# Altium schematic sheet TempController.SchDoc: TempController
size A3; ApprovedBy: ANBI; CheckedBy: ANBI; CompanyName: DongA FuelCell; DrawnBy: SEOKIPO; Engineer: SEOKIPO; Revision: 001; SheetNumber: 2; SheetTotal: 6
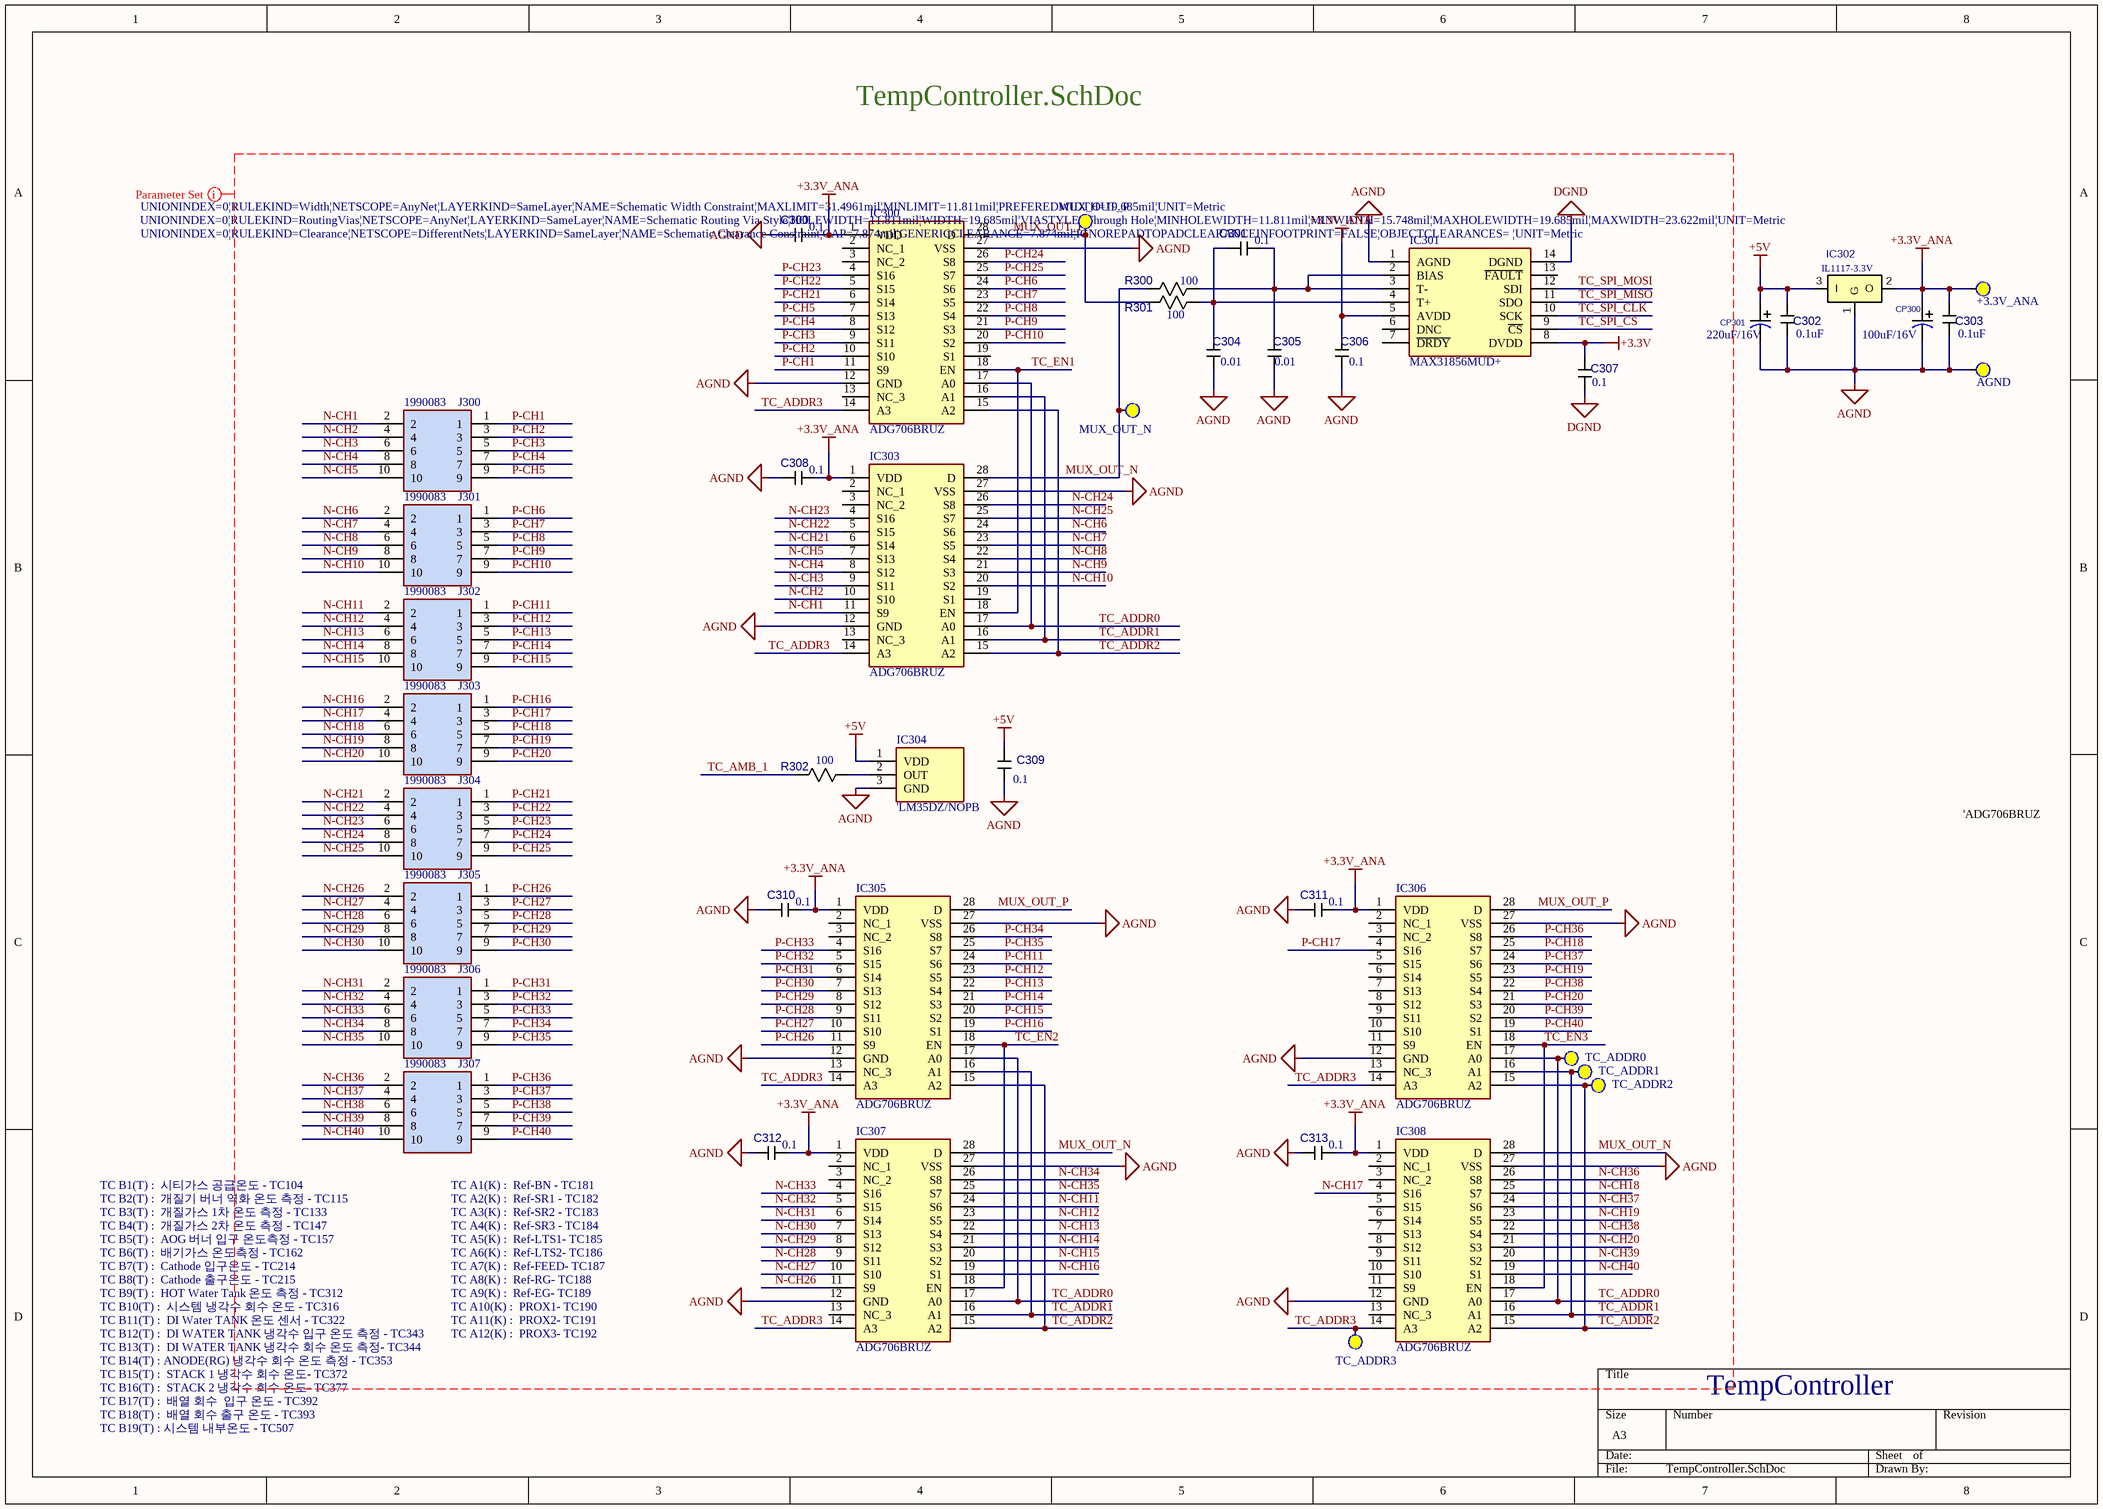
[diagram p0: TempController.SchDoc]

## Parts
+3.3V_ANA  Test Point_top  [TP_KEYSTONE_5000]  (value not drawn)
AGND  Test Point_top  [TP_KEYSTONE_5000]  (value not drawn)
C300  규격: 0.1  [CC1608N]  (hidden comment: CS1608)
C301  규격: 0.1  [CC1608N]  (hidden comment: CS1608)
C302  규격: 0.1uF  [CC1608N]  (hidden comment: CS1608)
C303  규격: 0.1uF  [CC1608N]  (hidden comment: CS1608)
C304  규격: 0.01  [CC1608N]  (hidden comment: CS1608)
C305  규격: 0.01  [CC1608N]  (hidden comment: CS1608)
C306  규격: 0.1  [CC1608N]  (hidden comment: CS1608)
C307  규격: 0.1  [CC1608N]  (hidden comment: CS1608)
C308  규격: 0.1  [CC1608N]  (hidden comment: CS1608)
C309  규격: 0.1  [CC1608N]  (hidden comment: CS1608)
C310  규격: 0.1  [CC1608N]  (hidden comment: CS1608)
C311  규격: 0.1  [CC1608N]  (hidden comment: CS1608)
C312  규격: 0.1  [CC1608N]  (hidden comment: CS1608)
C313  규격: 0.1  [CC1608N]  (hidden comment: CS1608)
CP300  규격: 100uF/16V  [CP5_SMT]  (hidden comment: CP5_SMT)
CP301  규격: 220uF/16V  [CP6_SMT]  (hidden comment: CP6_SMT)
IC300  ADG706BRUZ  [SOP65P640X120-28N]
IC301  MAX31856MUD+  [SOP65P640X110-14N]
IC302  Part No.: IL1117-3.3V  [SOT-223]  (hidden comment: 1117SO)
IC303  ADG706BRUZ  [SOP65P640X120-28N]
IC304  'LM35DZ/NOPB  [TO92]
IC305  ADG706BRUZ  [SOP65P640X120-28N]
IC306  ADG706BRUZ  [SOP65P640X120-28N]
IC307  ADG706BRUZ  [SOP65P640X120-28N]
IC308  ADG706BRUZ  [SOP65P640X120-28N]
J300  1990083  [1990083]
J301  1990083  [1990083]
J302  1990083  [1990083]
J303  1990083  [1990083]
J304  1990083  [1990083]
J305  1990083  [1990083]
J306  1990083  [1990083]
J307  1990083  [1990083]
MUX_OUT_N  Test Point_top  [TP_KEYSTONE_5000]  (value not drawn)
MUX_OUT_P  Test Point_top  [TP_KEYSTONE_5000]  (value not drawn)
R300  규격: 100  [RESC1608X55N]  (hidden comment: R1608)
R301  규격: 100  [RESC1608X55N]  (hidden comment: R1608)
R302  규격: 100  [RESC1608X55N]  (hidden comment: R1608)
TC_ADDR0  Test Point_top  [TP_KEYSTONE_5000]  (value not drawn)
TC_ADDR1  Test Point_top  [TP_KEYSTONE_5000]  (value not drawn)
TC_ADDR2  Test Point_top  [TP_KEYSTONE_5000]  (value not drawn)
TC_ADDR3  Test Point_top  [TP_KEYSTONE_5000]  (value not drawn)

## Nets
+3.3V: C307.2 IC301.8(DVDD)
+3.3V_ANA: +3.3V_ANA.1(tp) C300.1 C303.2 C306.2 C308.1 C310.1 C311.1 C312.1 C313.1 CP300.2 IC300.1(VDD) IC301.5(AVDD) IC302.2(O) IC303.1(VDD) IC305.1(VDD) IC306.1(VDD) IC307.1(VDD) IC308.1(VDD)
+5V: C302.2 C309.2 CP301.2 IC302.3(I) IC304.1(VDD)
AGND: AGND.1(tp) C300.2 C302.1 C303.1 C304.1 C305.2 C306.1 C308.2 C309.1 C310.2 C311.2 C312.2 C313.2 CP300.1 CP301.1 IC300.12(GND) IC300.27(VSS) IC301.1(AGND) IC302.1(G) IC303.12(GND) IC303.27(VSS) IC304.3(GND) IC305.12(GND) IC305.27(VSS) IC306.12(GND) IC306.27(VSS) IC307.12(GND) IC307.27(VSS) IC308.12(GND) IC308.27(VSS)
DGND: C307.1 IC301.14(DGND)
MUX_OUT_N: IC303.28(D) IC307.28(D) IC308.28(D) MUX_OUT_N.1(tp) R300.1
MUX_OUT_P: IC300.28(D) IC305.28(D) IC306.28(D) MUX_OUT_P.1(tp) R301.1
N-CH1: IC303.11(S9) J300.2
N-CH2: IC303.10(S10) J300.4
N-CH3: IC303.9(S11) J300.6
N-CH4: IC303.8(S12) J300.8
N-CH5: IC303.7(S13) J300.10
N-CH6: IC303.24(S6) J301.2
N-CH7: IC303.23(S5) J301.4
N-CH8: IC303.22(S4) J301.6
N-CH9: IC303.21(S3) J301.8
N-CH10: IC303.20(S2) J301.10
N-CH11: IC307.24(S6) J302.2
N-CH12: IC307.23(S5) J302.4
N-CH13: IC307.22(S4) J302.6
N-CH14: IC307.21(S3) J302.8
N-CH15: IC307.20(S2) J302.10
N-CH16: IC307.19(S1) J303.2
N-CH17: IC308.4(S16) J303.4
N-CH18: IC308.25(S7) J303.6
N-CH19: IC308.23(S5) J303.8
N-CH20: IC308.21(S3) J303.10
N-CH21: IC303.6(S14) J304.2
N-CH22: IC303.5(S15) J304.4
N-CH23: IC303.4(S16) J304.6
N-CH24: IC303.26(S8) J304.8
N-CH25: IC303.25(S7) J304.10
N-CH26: IC307.11(S9) J305.2
N-CH27: IC307.10(S10) J305.4
N-CH28: IC307.9(S11) J305.6
N-CH29: IC307.8(S12) J305.8
N-CH30: IC307.7(S13) J305.10
N-CH31: IC307.6(S14) J306.2
N-CH32: IC307.5(S15) J306.4
N-CH33: IC307.4(S16) J306.6
N-CH34: IC307.26(S8) J306.8
N-CH35: IC307.25(S7) J306.10
N-CH36: IC308.26(S8) J307.2
N-CH37: IC308.24(S6) J307.4
N-CH38: IC308.22(S4) J307.6
N-CH39: IC308.20(S2) J307.8
N-CH40: IC308.19(S1) J307.10
P-CH1: IC300.11(S9) J300.1
P-CH2: IC300.10(S10) J300.3
P-CH3: IC300.9(S11) J300.5
P-CH4: IC300.8(S12) J300.7
P-CH5: IC300.7(S13) J300.9
P-CH6: IC300.24(S6) J301.1
P-CH7: IC300.23(S5) J301.3
P-CH8: IC300.22(S4) J301.5
P-CH9: IC300.21(S3) J301.7
P-CH10: IC300.20(S2) J301.9
P-CH11: IC305.24(S6) J302.1
P-CH12: IC305.23(S5) J302.3
P-CH13: IC305.22(S4) J302.5
P-CH14: IC305.21(S3) J302.7
P-CH15: IC305.20(S2) J302.9
P-CH16: IC305.19(S1) J303.1
P-CH17: IC306.4(S16) J303.3
P-CH18: IC306.25(S7) J303.5
P-CH19: IC306.23(S5) J303.7
P-CH20: IC306.21(S3) J303.9
P-CH21: IC300.6(S14) J304.1
P-CH22: IC300.5(S15) J304.3
P-CH23: IC300.4(S16) J304.5
P-CH24: IC300.26(S8) J304.7
P-CH25: IC300.25(S7) J304.9
P-CH26: IC305.11(S9) J305.1
P-CH27: IC305.10(S10) J305.3
P-CH28: IC305.9(S11) J305.5
P-CH29: IC305.8(S12) J305.7
P-CH30: IC305.7(S13) J305.9
P-CH31: IC305.6(S14) J306.1
P-CH32: IC305.5(S15) J306.3
P-CH33: IC305.4(S16) J306.5
P-CH34: IC305.26(S8) J306.7
P-CH35: IC305.25(S7) J306.9
P-CH36: IC306.26(S8) J307.1
P-CH37: IC306.24(S6) J307.3
P-CH38: IC306.22(S4) J307.5
P-CH39: IC306.20(S2) J307.7
P-CH40: IC306.19(S1) J307.9
TC_ADDR0: IC300.17(A0) IC303.17(A0) IC305.17(A0) IC306.17(A0) IC307.17(A0) IC308.17(A0) TC_ADDR0.1(tp)
TC_ADDR1: IC300.16(A1) IC303.16(A1) IC305.16(A1) IC306.16(A1) IC307.16(A1) IC308.16(A1) TC_ADDR1.1(tp)
TC_ADDR2: IC300.15(A2) IC303.15(A2) IC305.15(A2) IC306.15(A2) IC307.15(A2) IC308.15(A2) TC_ADDR2.1(tp)
TC_ADDR3: IC300.14(A3) IC303.14(A3) IC305.14(A3) IC306.14(A3) IC307.14(A3) IC308.14(A3) TC_ADDR3.1(tp)
TC_AMB_1: R302.1
TC_EN1: IC300.18(EN) IC303.18(EN)
TC_EN2: IC305.18(EN) IC307.18(EN)
TC_EN3: IC306.18(EN) IC308.18(EN)
TC_SPI_CLK: IC301.10(SCK)
TC_SPI_CS: IC301.9(~{CS})
TC_SPI_MISO: IC301.11(SDO)
TC_SPI_MOSI: IC301.12(SDI)
NetC301_1: C301.1 C305.1 IC301.2(BIAS) IC301.3(T-) R300.2
NetC301_2: C301.2 C304.2 IC301.4(T+) R301.2
NetIC304_2: IC304.2(OUT) R302.2

Not connected (* = marked no-connect by the designer): IC300 2(NC_1) 3(NC_2) 13(NC_3) 19(S1); IC301 6(DNC) 7(~{DRDY}) 13(~{FAULT}); IC302 4; IC303 2(NC_1) 3(NC_2) 13(NC_3) 19(S1); IC305 2(NC_1) 3(NC_2) 13(NC_3); IC306 2(NC_1) 3(NC_2) 5(S15) 6(S14) 7(S13) 8(S12) 9(S11) 10(S10) 11(S9) 13(NC_3); IC307 2(NC_1) 3(NC_2) 13(NC_3); IC308 2(NC_1) 3(NC_2) 5(S15) 6(S14) 7(S13) 8(S12) 9(S11) 10(S10) 11(S9) 13(NC_3)

## Layout directives
rule Width Constraint [Pref Width = 0.5mm    Min Width = 0.3mm    Max Width = 0.8mm]; rule Routing Via Style [Pref Size = 0.5mm    Pref Hole Size = 0.3mm]; rule Clearance Constraint [Clearance = 0.2mm]: +3.3V, +3.3V_ANA, +5V, AGND, DGND, MUX_OUT_N, MUX_OUT_P, N-CH1, N-CH2, N-CH3, N-CH4, N-CH5, N-CH6, N-CH7, N-CH8, N-CH9, N-CH10, N-CH11, N-CH12, N-CH13, N-CH14, N-CH15, N-CH16, N-CH17, N-CH18, N-CH19, N-CH20, N-CH21, N-CH22, N-CH23, N-CH24, N-CH25, N-CH26, N-CH27, N-CH28, N-CH29, N-CH30, N-CH31, N-CH32, N-CH33, N-CH34, N-CH35, N-CH36, N-CH37, N-CH38, N-CH39, N-CH40, P-CH1, P-CH2, P-CH3, P-CH4, P-CH5, P-CH6, P-CH7, P-CH8, P-CH9, P-CH10, P-CH11, P-CH12, P-CH13, P-CH14, P-CH15, P-CH16, P-CH17, P-CH18, P-CH19, P-CH20, P-CH21, P-CH22, P-CH23, P-CH24, P-CH25, P-CH26, P-CH27, P-CH28, P-CH29, P-CH30, P-CH31, P-CH32, P-CH33, P-CH34, P-CH35, P-CH36, P-CH37, P-CH38, P-CH39, P-CH40, TC_ADDR0, TC_ADDR1, TC_ADDR2, TC_ADDR3, TC_AMB_1, TC_EN1, TC_EN2, TC_EN3, TC_SPI_CLK, TC_SPI_CS, TC_SPI_MISO, TC_SPI_MOSI

## Notes on the sheet
- TempController.SchDoc
- 'ADG706BRUZ
- TC B1(T) :  시티가스 공급온도 - TC104
- (near J307) TC A1(K) :  Ref-BN - TC181
- TC B2(T) :  개질기 버너 역화 온도 측정 - TC115
- TC B3(T) :  개질가스 1차 온도 측정 - TC133
- TC B5(T) :  AOG 버너 입구 온도측정 - TC157
- TC B4(T) :  개질가스 2차 온도 측정 - TC147
- TC B6(T) :  배기가스 온도측정 - TC162
- TC A2(K) :  Ref-SR1 - TC182
- TC A3(K) :  Ref-SR2 - TC183
- TC A4(K) :  Ref-SR3 - TC184
- TC A5(K) :  Ref-LTS1- TC185
- TC A6(K) :  Ref-LTS2- TC186
- TC B7(T) :  Cathode 입구온도 - TC214
- TC B8(T) :  Cathode 출구온도 - TC215
- TC B9(T) :  HOT Water Tank 온도 측정 - TC312
- TC B10(T) :  시스템 냉각수 회수 온도 - TC316
- TC B11(T) :  DI Water TANK 온도 센서 - TC322
- TC A8(K) :  Ref-RG- TC188
- TC A9(K) :  Ref-EG- TC189
- TC A10(K) :  PROX1- TC190
- TC A7(K) :  Ref-FEED- TC187
- TC A11(K) :  PROX2- TC191
- TC B12(T) :  DI WATER TANK 냉각수 입구 온도 측정 - TC343
- TC B13(T) :  DI WATER TANK 냉각수 회수 온도 측정- TC344
- TC B14(T) : ANODE(RG) 냉각수 회수 온도 측정 - TC353
- TC B15(T) :  STACK 1 냉각수 회수 온도- TC372
- TC B16(T) :  STACK 2 냉각수 회수 온도- TC377
- TC A12(K) :  PROX3- TC192
- TC B17(T) :  배열 회수  입구 온도 - TC392
- TC B18(T) :  배열 회수 출구 온도 - TC393
- TC B19(T) : 시스템 내부온도 - TC507

## Library data of the parts
+3.3V_ANA AGND MUX_OUT_N MUX_OUT_P TC_ADDR0 TC_ADDR1 TC_ADDR3 = Tp_5000: Pad30; Part No.: *
C300-C313 = CS1608: Part No.: {Part No}; Price: 6
CP300 = CP5_SMT: Part No.: {Part No}; Price: 31
CP301 = CP6_SMT: Part No.: RV16V220 6.3X7.7 (ELNA / 삼영); ComponentLink1Description: New link; ComponentLink1URL: *; Price: 40
IC300 IC303 IC305 IC307 IC308 = ADG706BRU-REEL7: Integrated Circuit; Manufacturer_Name: Analog Devices; Height: 1.2mm; Manufacturer_Part_Number: ADG706BRU-REEL7; Price: 7220; Part No.: ADG706BRUZ
IC301 = MAX31856MUD+: Integrated Circuit; Height: 1.1mm; Part No.: MAX31856MUD+; Price: 4490
IC302 = 1117SO: Value: 3.3V/1A; Price: 150
IC304 = LM35: Integrated Circuit; Height: 4.95mm; Price: 610; Part No.: LM35DZ/NOPB
IC306 = ADG706BRU-REEL7: Integrated Circuit; Price: 7220; Part No.: ADG706BRUZ
J300-J307 = 1990083: PTSA 0,5/10-2,5-Z - Printed circuit board terminal, nominal current: 2 A, rated voltage (III/2): 250 V, nominal cross section: 0.5 mm<sup>2</sup>, number of potentials: 10, number of rows: 1, number of positions per row: 10, product range: PTSA 0,5, pitch: 2.5 mm, connection method: Push-in spring connection, mounting: Wave soldering, conductor/PCB connection direction: 45 , color: green, Pin layout: Zigzag pinning W, Solder pin [P]: 3.6 mm, number of solder pins per potential: 1, type of packaging: packed; Manufacturer_Name: Phoenix Contact; Geometry.Height: 13.1mm; Part No.: 1990083; Price: 2320
  J300: Mouser Price/Stock: https://www.mouser.co.uk/ProductDetail/Phoenix-Contact/1990083?qs=eiqBpq341KUxP7V1ZFOCBQ%3D%3D
  J301-J307: Arrow Price/Stock: https://www.arrow.com/en/products/1990083/phoenix-contact.html?utm_currency=USD&region=nac
R300-R302 = R1608: Part No.: WR06X101JT(100R)J; Price: 1.0
TC_ADDR2 = Tp_5000: Pad30; NetName: .NetName; Part No.: *